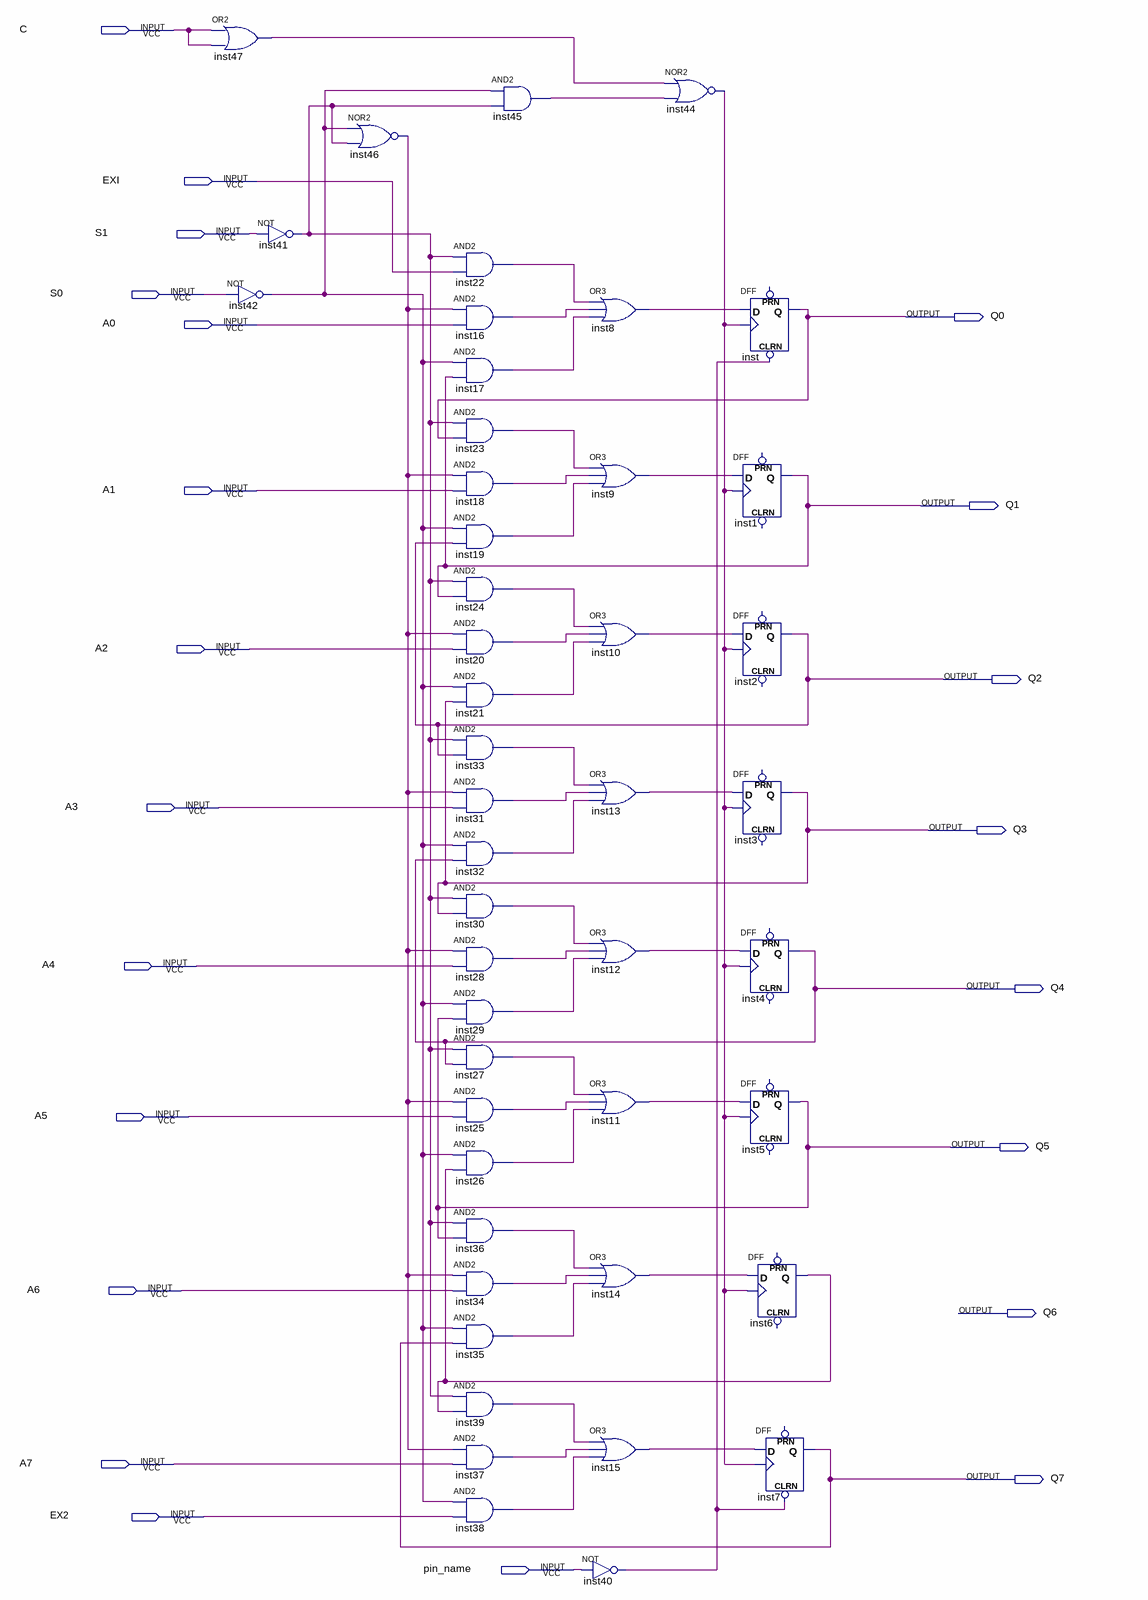
[diagram p0: schematic sheet]
// Quartus schematic kp1533ir10.bdf as structural Verilog: 47 symbols, 22 pins
module kp1533ir10 (
  input  C,
  input  EXI,
  input  S1,
  input  S0,
  input  A0,
  input  A1,
  input  A2,
  input  A3,
  input  A4,
  input  A5,
  input  A6,
  input  A7,
  input  EX2,
  input  pin_name,
  output Q0,
  output Q1,
  output Q2,
  output Q3,
  output Q4,
  output Q5,
  output Q6,
  output Q7
);

  wire inst6_q, inst8_out, inst9_out, inst10_out, inst11_out, inst12_out, inst13_out, inst14_out, inst15_out,
       inst16_out, inst17_out, inst18_out, inst19_out, inst20_out, inst21_out, inst22_out, inst23_out,
       inst24_out, inst25_out, inst26_out, inst27_out, inst28_out, inst29_out, inst30_out, inst31_out,
       inst32_out, inst33_out, inst34_out, inst35_out, inst36_out, inst37_out, inst38_out, inst39_out,
       inst40_out, inst41_out, inst42_out, inst44_out, inst45_out, inst46_out, inst47_out;

  or inst47 (inst47_out, C, C);
  not inst42 (inst42_out, S0);
  not inst41 (inst41_out, S1);
  nor inst46 (inst46_out, inst42_out, inst41_out);
  and inst22 (inst22_out, inst41_out, EXI);
  and inst16 (inst16_out, inst46_out, A0);
  and inst17 (inst17_out, inst42_out, Q1);
  and inst23 (inst23_out, inst41_out, Q0);
  and inst18 (inst18_out, inst46_out, A1);
  and inst19 (inst19_out, inst42_out, Q2);
  and inst24 (inst24_out, inst41_out, Q1);
  and inst20 (inst20_out, inst46_out, A2);
  and inst21 (inst21_out, inst42_out, Q3);
  and inst33 (inst33_out, inst41_out, Q2);
  and inst31 (inst31_out, inst46_out, A3);
  and inst32 (inst32_out, inst42_out, Q4);
  and inst30 (inst30_out, inst41_out, Q3);
  and inst28 (inst28_out, inst46_out, A4);
  and inst29 (inst29_out, inst42_out, Q5);
  and inst27 (inst27_out, inst41_out, Q4);
  and inst25 (inst25_out, inst46_out, A5);
  and inst26 (inst26_out, inst42_out, inst6_q);
  and inst36 (inst36_out, inst41_out, Q5);
  and inst34 (inst34_out, inst46_out, A6);
  and inst35 (inst35_out, inst42_out, Q7);
  and inst39 (inst39_out, inst41_out, inst6_q);
  and inst37 (inst37_out, inst46_out, A7);
  and inst38 (inst38_out, inst42_out, EX2);
  and inst45 (inst45_out, inst42_out, inst41_out);
  or inst8 (inst8_out, inst22_out, inst16_out, inst17_out);
  or inst9 (inst9_out, inst23_out, inst18_out, inst19_out);
  or inst10 (inst10_out, inst24_out, inst20_out, inst21_out);
  or inst13 (inst13_out, inst33_out, inst31_out, inst32_out);
  or inst12 (inst12_out, inst30_out, inst28_out, inst29_out);
  or inst11 (inst11_out, inst27_out, inst25_out, inst26_out);
  or inst14 (inst14_out, inst36_out, inst34_out, inst35_out);
  or inst15 (inst15_out, inst39_out, inst37_out, inst38_out);
  not inst40 (inst40_out, pin_name);
  nor inst44 (inst44_out, inst47_out, inst45_out);
  DFF inst (.CLRN(inst40_out), .CLK(inst44_out), .D(inst8_out), .Q(Q0));  // open: PRN
  DFF inst1 (.CLK(inst44_out), .D(inst9_out), .Q(Q1));  // open: CLRN, PRN
  DFF inst2 (.CLK(inst44_out), .D(inst10_out), .Q(Q2));  // open: CLRN, PRN
  DFF inst3 (.CLK(inst44_out), .D(inst13_out), .Q(Q3));  // open: CLRN, PRN
  DFF inst4 (.CLK(inst44_out), .D(inst12_out), .Q(Q4));  // open: CLRN, PRN
  DFF inst5 (.CLK(inst44_out), .D(inst11_out), .Q(Q5));  // open: CLRN, PRN
  DFF inst6 (.CLK(inst44_out), .D(inst14_out), .Q(inst6_q));  // open: CLRN, PRN
  DFF inst7 (.CLRN(inst40_out), .CLK(inst44_out), .D(inst15_out), .Q(Q7));  // open: PRN
endmodule
